# Altium schematic sheet 05_Cardreader.SchDoc
size A3
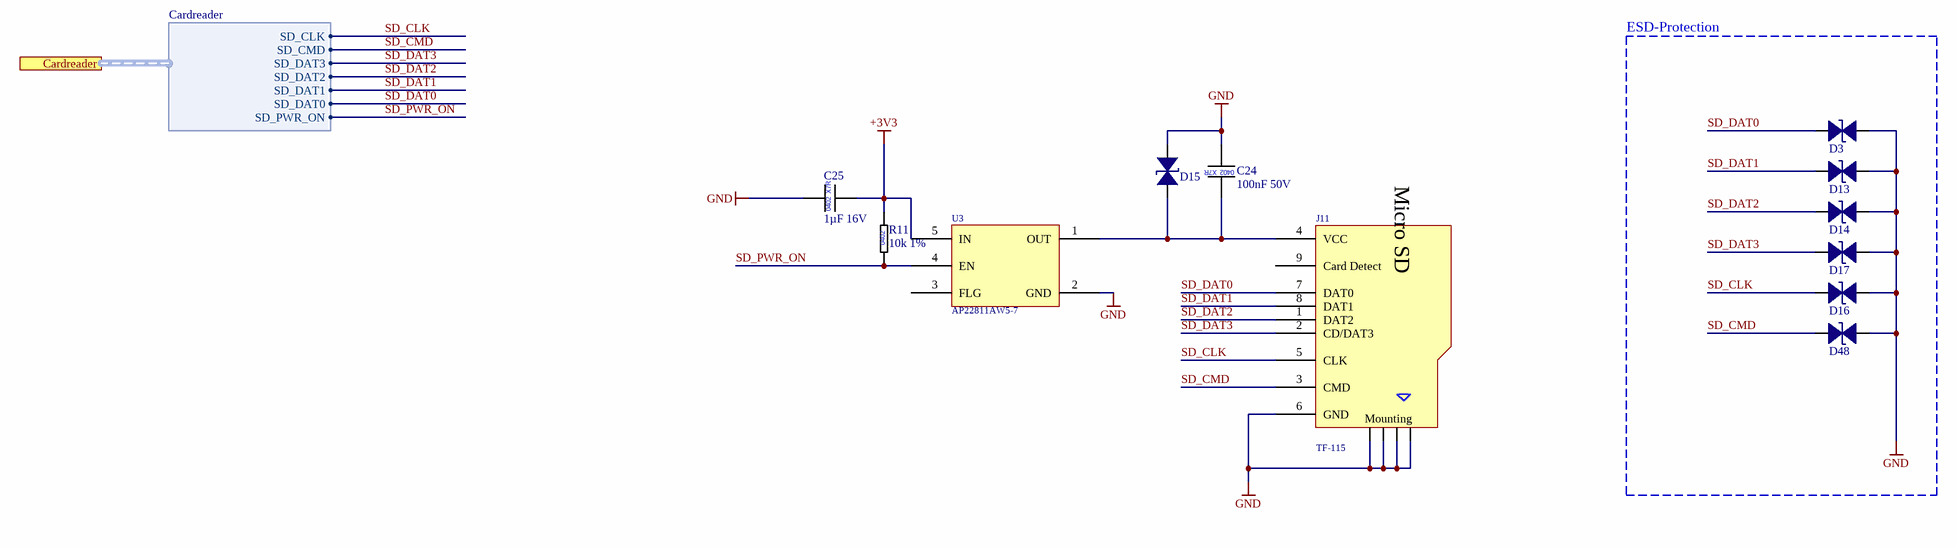
[diagram p0: 05_Cardreader.SchDoc]

## Parts
C24  100nF 50V  [CAP_0402]
C25  1µF 16V  [CAP_0402]
D3  CESDP0402UC5VB  [TVS_0402]  (value not drawn)
D13  CESDP0402UC5VB  [TVS_0402]  (value not drawn)
D14  CESDP0402UC5VB  [TVS_0402]  (value not drawn)
D15  CESDP0402UC5VB  [TVS_0402]  (value not drawn)
D16  CESDP0402UC5VB  [TVS_0402]  (value not drawn)
D17  CESDP0402UC5VB  [TVS_0402]  (value not drawn)
D48  CESDP0402UC5VB  [TVS_0402]  (value not drawn)
J11  TF-115  [TF-115]
R11  10k 1%  [RES_0402]
U3  AP22811AW5-7  [SOT95P285X140-5N]

## Blocks framed on the sheet
ESD-Protection: D3 D13 D14 D16 D17 D48

## Ports
Cardreader (harness Cardreader)

## Harnesses
Cardreader: SD_DAT0, SD_DAT1, SD_DAT2, SD_DAT3, SD_CMD, SD_CLK, SD_PWR_ON

## Nets
+3V3: C25.2 R11.2 U3.5(IN)
GND: C24.2 C25.1 D3.2 D13.2 D14.2 D15.2 D16.2 D17.2 D48.2 J11.6(GND) J11.10 J11.11 J11.12 J11.13 U3.2(GND)
SD_CLK: D16.1 J11.5(CLK) ; port Cardreader.SD_CLK
SD_CMD: D48.1 J11.3(CMD) ; port Cardreader.SD_CMD
SD_DAT0: D3.1 J11.7(DAT0) ; port Cardreader.SD_DAT0
SD_DAT1: D13.1 J11.8(DAT1) ; port Cardreader.SD_DAT1
SD_DAT2: D14.1 J11.1(DAT2) ; port Cardreader.SD_DAT2
SD_DAT3: D17.1 J11.2(CD/DAT3) ; port Cardreader.SD_DAT3
SD_PWR_ON: R11.1 U3.4(EN) ; port Cardreader.SD_PWR_ON
NetC24_1: C24.1 D15.1 J11.4(VCC) U3.1(OUT)

Not connected (* = marked no-connect by the designer): J11 9(Card_Detect); U3 3(FLG)

## Notes on the sheet
- Title:
- ++CONFIDENTIAL++
- Date:
- Sheet:
- /
- Time:
- Engineer
- Elektronik- und Softwareentwicklung aus Nürnberg
- The  information  contained  in  these  documents  is  confidential,  privileged  and  only  for  the
  information of the intended recipient and may
  not be used, published or redistributed without
  the prior written consent from PCB Arts GmbH.
- Revision:
- Checked:
- https://pcb-arts.com/
- mail@pcb-arts.com
- (in symbol CAP_0402_1µF_16V) X7R; 0402
- (in symbol CAP_0402_100nF_50V) X7R; 0402
- (in symbol RES_0402_10k_1%) 0402
- (in symbol TF-115_microSD™ Memory Card 8 connector) Micro SD; Mounting

## Library data of the parts
C24 = CAP_0402_100nF_50V: Multilayer Ceramic Capacitors MLCC - SMD/SMT 0402 50VDC; Manufacturer 1: Murata Electronics; Manufacturer 1 Prt. Nr.: GCM155L8EH104KE07D; Manufacturer 2 Prt. Nr.: UMK105B7104KV-FR; Manufacturer 2: TDK
C25 = CAP_0402_1µF_16V: Multilayer Ceramic Capacitors MLCC - SMD/SMT 0402 16VDC; Manufacturer 1: Taiyo Yuden; Manufacturer 1 Prt. Nr.: EMK105BJ105MVHF; Manufacturer 2 Prt. Nr.: GRM155R61E105KA12D; Manufacturer 2: Murata Electronics
D3 D13-D17 D48 = CESDP0402UC5VB_TVS Diode 0402: Low Capacitance ESD Protection Diode 0402; Manufacturer 1: CREATEK; Manufacturer 2 Prt. Nr.: BPESD0402-05ST; Manufacturer 1 Prt. Nr.: CESDP0402UC5VB; Manufacturer 2: BORN
J11 = TF-115_microSD™ Memory Card 8 connector: microSD™ Memory Card 8 connector&Ejector 14.5x14.75x1.85mm Card Sockets Connector; Manufacturer 1: XUNPU; Manufacturer 1 Prt. Nr.: TF-115
R11 = RES_0402_10k_1%: Thick Film Resistors - SMD 10kOhm 1%; Manufacturer 1: Vishay / Dale; Manufacturer 1 Prt. Nr.: CRCW040210K0FKEDC; Manufacturer 2 Prt. Nr.: RC0402FR-7W10KL; Manufacturer 2: Yageo
U3 = AP22811AW5-7_Power Switch ICs - Power Distribution Load Switch: Power Switch ICs - Power Distribution Load Switch; Manufacturer 1: Diodes Incorporated; Manufacturer 1 Prt. Nr.: AP22811AW5-7